# EAGLE design PixelWing_rev0.1 (EAGLE 9.5.2)
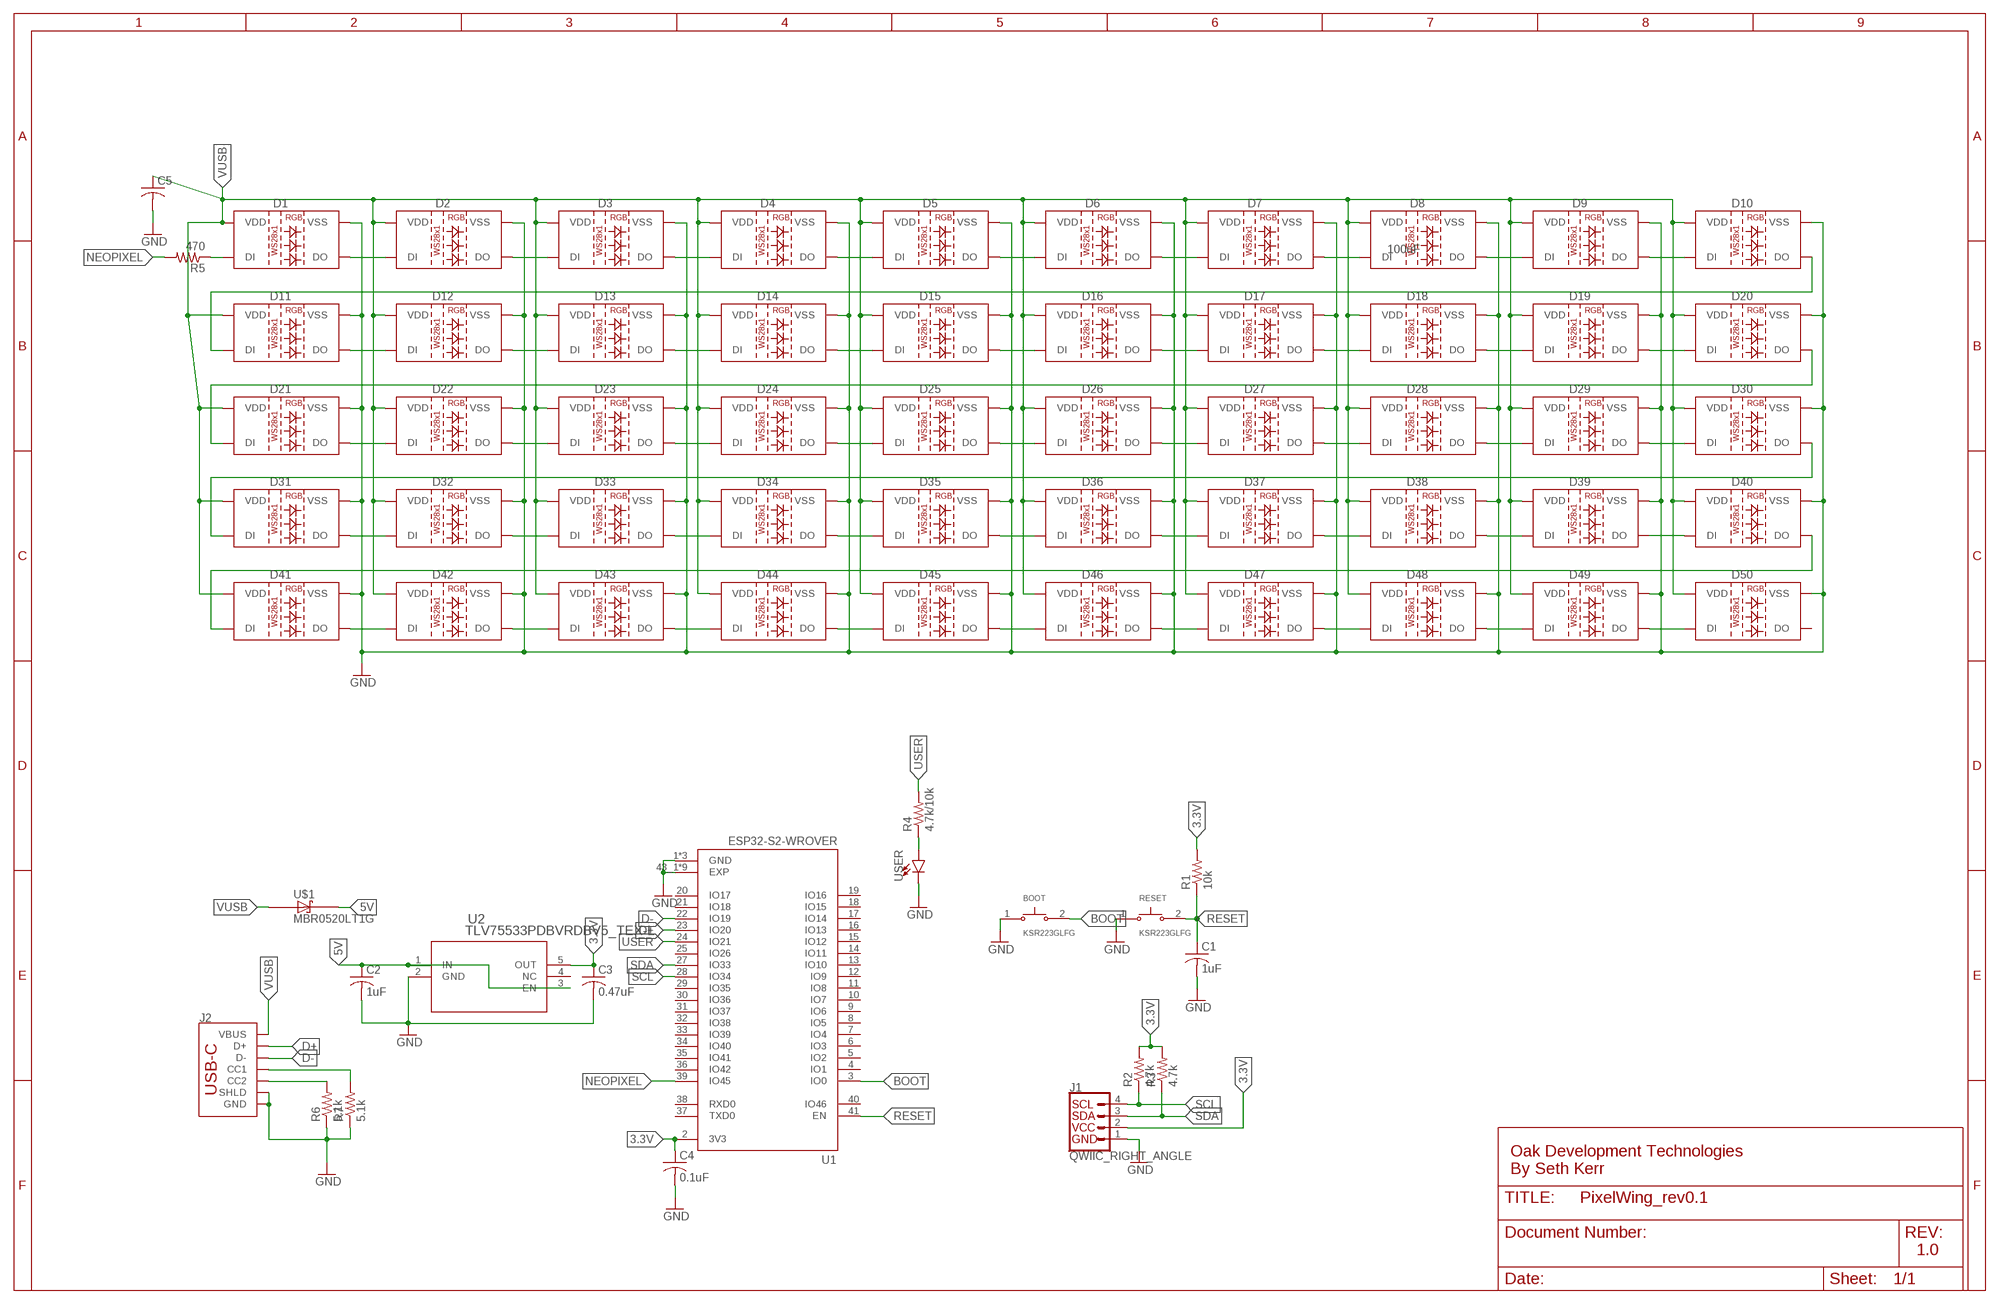
[diagram p0: schematic, sheet 1]

## Parts
BOOT  KSR223GLFG  [SW_KSR223GLFG]
C1  1uF  C-USC0603  [C0603]
C2  1uF  C-USC0603  [C0603]
C3  0.47uF  C-USC0603  [C0603]
C4  0.1uF  C-USC0603  [C0603]
C5  100uF  C-USC1206  [C1206]
D1  WS2812BWS2812B-3535  [WS2812-3535]
D2  WS2812BWS2812B-3535  [WS2812-3535]
D3  WS2812BWS2812B-3535  [WS2812-3535]
D4  WS2812BWS2812B-3535  [WS2812-3535]
D5  WS2812BWS2812B-3535  [WS2812-3535]
D6  WS2812BWS2812B-3535  [WS2812-3535]
D7  WS2812BWS2812B-3535  [WS2812-3535]
D8  WS2812BWS2812B-3535  [WS2812-3535]
D9  WS2812BWS2812B-3535  [WS2812-3535]
D10  WS2812BWS2812B-3535  [WS2812-3535]
D11  WS2812BWS2812B-3535  [WS2812-3535]
D12  WS2812BWS2812B-3535  [WS2812-3535]
D13  WS2812BWS2812B-3535  [WS2812-3535]
D14  WS2812BWS2812B-3535  [WS2812-3535]
D15  WS2812BWS2812B-3535  [WS2812-3535]
D16  WS2812BWS2812B-3535  [WS2812-3535]
D17  WS2812BWS2812B-3535  [WS2812-3535]
D18  WS2812BWS2812B-3535  [WS2812-3535]
D19  WS2812BWS2812B-3535  [WS2812-3535]
D20  WS2812BWS2812B-3535  [WS2812-3535]
D21  WS2812BWS2812B-3535  [WS2812-3535]
D22  WS2812BWS2812B-3535  [WS2812-3535]
D23  WS2812BWS2812B-3535  [WS2812-3535]
D24  WS2812BWS2812B-3535  [WS2812-3535]
D25  WS2812BWS2812B-3535  [WS2812-3535]
D26  WS2812BWS2812B-3535  [WS2812-3535]
D27  WS2812BWS2812B-3535  [WS2812-3535]
D28  WS2812BWS2812B-3535  [WS2812-3535]
D29  WS2812BWS2812B-3535  [WS2812-3535]
D30  WS2812BWS2812B-3535  [WS2812-3535]
D31  WS2812BWS2812B-3535  [WS2812-3535]
D32  WS2812BWS2812B-3535  [WS2812-3535]
D33  WS2812BWS2812B-3535  [WS2812-3535]
D34  WS2812BWS2812B-3535  [WS2812-3535]
D35  WS2812BWS2812B-3535  [WS2812-3535]
D36  WS2812BWS2812B-3535  [WS2812-3535]
D37  WS2812BWS2812B-3535  [WS2812-3535]
D38  WS2812BWS2812B-3535  [WS2812-3535]
D39  WS2812BWS2812B-3535  [WS2812-3535]
D40  WS2812BWS2812B-3535  [WS2812-3535]
D41  WS2812BWS2812B-3535  [WS2812-3535]
D42  WS2812BWS2812B-3535  [WS2812-3535]
D43  WS2812BWS2812B-3535  [WS2812-3535]
D44  WS2812BWS2812B-3535  [WS2812-3535]
D45  WS2812BWS2812B-3535  [WS2812-3535]
D46  WS2812BWS2812B-3535  [WS2812-3535]
D47  WS2812BWS2812B-3535  [WS2812-3535]
D48  WS2812BWS2812B-3535  [WS2812-3535]
D49  WS2812BWS2812B-3535  [WS2812-3535]
D50  WS2812BWS2812B-3535  [WS2812-3535]
J1  QWIIC_RIGHT_ANGLE  QWIIC_CONNECTORJS-1MM  [JST04_1MM_RA]
J2  USB_C_2-LAYER_PADS  [USB-C-16P-2LAYER-PADS]
R1  10k  R-US_R0603  [R0603]
R2  4.7k  R-US_R0603  [R0603]
R3  4.7k  R-US_R0603  [R0603]
R4  4.7k/10k  R-US_R0603  [R0603]
R5  470  R-US_R0603  [R0603]
R6  5.1k  R-US_R0603  [R0603]
R7  5.1k  R-US_R0603  [R0603]
RESET  KSR223GLFG  [SW_KSR223GLFG]
U1  ESP32-S2-WROVER  [MODULE_ESP32-S2-WROVER]
U2  TLV75533PDBVRDBV5_TEX-L  [DBV5_TEX-L]
U$1  MBR0520LT1G  [SOD3716X117(SOD-123)]
USER  LED0603  [LED-0603]

## Nets
3.3V: C3.1 C4.1 J1.2 R1.2 R2.2 R3.2 U1.2(3V3) U2.5(OUT)
5V: C2.1 U2.1(IN) U2.3(EN) U$1.1(C)
BOOT: BOOT.2 U1.3(IO0)
D+: J2.A6(D+) J2.B6(D+) U1.23(IO20)
D-: J2.A7(D-) J2.B7(D-) U1.22(IO19)
GND: BOOT.1 C1.2 C2.2 C3.2 C4.2 C5.2 D1.VSS D2.VSS D3.VSS D4.VSS D5.VSS D6.VSS D7.VSS D8.VSS D9.VSS D10.VSS D11.VSS D12.VSS D13.VSS D14.VSS D15.VSS D16.VSS D17.VSS D18.VSS D19.VSS D20.VSS D21.VSS D22.VSS D23.VSS D24.VSS D25.VSS D26.VSS D27.VSS D28.VSS D29.VSS D30.VSS D31.VSS D32.VSS D33.VSS D34.VSS D35.VSS D36.VSS D37.VSS D38.VSS D39.VSS D40.VSS D41.VSS D42.VSS D43.VSS D44.VSS D45.VSS D46.VSS D47.VSS D48.VSS D49.VSS D50.VSS J1.1 J2.GND J2.GND2(GND) J2.P$1(SHLD) J2.P$2(SHLD) J2.P$3(SHLD) J2.P$4(SHLD) J2.SHLD1(SHLD) J2.SHLD2(SHLD) J2.SHLD3(SHLD) J2.SHLD4(SHLD) R6.1 R7.1 RESET.1 U1.1(GND) U1.26(GND) U1.42(GND) U1.43_1(EXP) U1.43_2(EXP) U1.43_3(EXP) U1.43_4(EXP) U1.43_5(EXP) U1.43_6(EXP) U1.43_7(EXP) U1.43_8(EXP) U1.43_9(EXP) U2.2(GND) USER.C
N$1: R4.1 USER.A
N$2: D1.DIN(DI) R5.1
N$6: J2.A5(CC1) R7.2
N$7: J2.B5(CC2) R6.2
N$10: D41.DOUT(DO) D42.DIN(DI)
N$11: D42.DOUT(DO) D43.DIN(DI)
N$12: D43.DOUT(DO) D44.DIN(DI)
N$13: D44.DOUT(DO) D45.DIN(DI)
N$14: D45.DOUT(DO) D46.DIN(DI)
N$15: D46.DOUT(DO) D47.DIN(DI)
N$16: D47.DOUT(DO) D48.DIN(DI)
N$17: D48.DOUT(DO) D49.DIN(DI)
N$18: D49.DOUT(DO) D50.DIN(DI)
N$19: D40.DOUT(DO) D41.DIN(DI)
N$20: D31.DOUT(DO) D32.DIN(DI)
N$21: D32.DOUT(DO) D33.DIN(DI)
N$22: D33.DOUT(DO) D34.DIN(DI)
N$23: D34.DOUT(DO) D35.DIN(DI)
N$24: D35.DOUT(DO) D36.DIN(DI)
N$25: D36.DOUT(DO) D37.DIN(DI)
N$26: D37.DOUT(DO) D38.DIN(DI)
N$27: D38.DOUT(DO) D39.DIN(DI)
N$28: D39.DOUT(DO) D40.DIN(DI)
N$29: D30.DOUT(DO) D31.DIN(DI)
N$30: D21.DOUT(DO) D22.DIN(DI)
N$31: D22.DOUT(DO) D23.DIN(DI)
N$32: D23.DOUT(DO) D24.DIN(DI)
N$33: D24.DOUT(DO) D25.DIN(DI)
N$34: D25.DOUT(DO) D26.DIN(DI)
N$35: D26.DOUT(DO) D27.DIN(DI)
N$36: D27.DOUT(DO) D28.DIN(DI)
N$37: D28.DOUT(DO) D29.DIN(DI)
N$38: D29.DOUT(DO) D30.DIN(DI)
N$39: D20.DOUT(DO) D21.DIN(DI)
N$40: D11.DOUT(DO) D12.DIN(DI)
N$41: D12.DOUT(DO) D13.DIN(DI)
N$42: D13.DOUT(DO) D14.DIN(DI)
N$43: D14.DOUT(DO) D15.DIN(DI)
N$44: D15.DOUT(DO) D16.DIN(DI)
N$45: D16.DOUT(DO) D17.DIN(DI)
N$46: D17.DOUT(DO) D18.DIN(DI)
N$47: D18.DOUT(DO) D19.DIN(DI)
N$48: D19.DOUT(DO) D20.DIN(DI)
N$49: D10.DOUT(DO) D11.DIN(DI)
N$50: D1.DOUT(DO) D2.DIN(DI)
N$51: D2.DOUT(DO) D3.DIN(DI)
N$52: D3.DOUT(DO) D4.DIN(DI)
N$53: D4.DOUT(DO) D5.DIN(DI)
N$54: D5.DOUT(DO) D6.DIN(DI)
N$55: D6.DOUT(DO) D7.DIN(DI)
N$56: D7.DOUT(DO) D8.DIN(DI)
N$57: D8.DOUT(DO) D9.DIN(DI)
N$58: D9.DOUT(DO) D10.DIN(DI)
NEOPIXEL: R5.2 U1.39(IO45)
RESET: C1.1 R1.1 RESET.2 U1.41(EN)
SCL: J1.4 R2.1 U1.28(IO34)
SDA: J1.3 R3.1 U1.27(IO33)
USER: R4.2 U1.24(IO21)
VUSB: C5.1 D1.VDD D2.VDD D3.VDD D4.VDD D5.VDD D6.VDD D7.VDD D8.VDD D9.VDD D10.VDD D11.VDD D12.VDD D13.VDD D14.VDD D15.VDD D16.VDD D17.VDD D18.VDD D19.VDD D20.VDD D21.VDD D22.VDD D23.VDD D24.VDD D25.VDD D26.VDD D27.VDD D28.VDD D29.VDD D30.VDD D31.VDD D32.VDD D33.VDD D34.VDD D35.VDD D36.VDD D37.VDD D38.VDD D39.VDD D40.VDD D41.VDD D42.VDD D43.VDD D44.VDD D45.VDD D46.VDD D47.VDD D48.VDD D49.VDD D50.VDD J2.VBUS1(VBUS) J2.VBUS2(VBUS) U$1.2(A)
Unconnected: D50.DOUT(DO) U1.4(IO1) U1.5(IO2) U1.6(IO3) U1.7(IO4) U1.8(IO5) U1.9(IO6) U1.10(IO7) U1.11(IO8) U1.12(IO9) U1.13(IO10) U1.14(IO11) U1.15(IO12) U1.16(IO13) U1.17(IO14) U1.18(IO15) U1.19(IO16) U1.20(IO17) U1.21(IO18) U1.25(IO26) U1.29(IO35) U1.30(IO36) U1.31(IO37) U1.32(IO38) U1.33(IO39) U1.34(IO40) U1.35(IO41) U1.36(IO42) U1.37(TXD0) U1.38(RXD0) U1.40(IO46) U2.4(NC)

## Notes on the sheet
- Oak Development Technologies
  By Seth Kerr
- 1.0

## Library data of the parts
BOOT RESET = KSR223GLFG:KSR223GLFG: Switch Tactile N.O. SPST Round Button Gull Wing 0.01A 32VDC 0.2VA 200000Cycles 2N SMD Automotive T/R; AVAILABILITY: Unavailable; DESCRIPTION: Tactile Switch SPST-NO Top Actuated Surface Mount; MF: C&K; MP: KSR223GLFG; PACKAGE: None; PRICE: None
C1-C5 = rcl:C-US: CAPACITOR, American symbol; SPICEPREFIX: C
D1-D50 = SparkFun-LED:WS2812B: WS2812B SMD addressable RGB LED 5x5mm SMD LED with built-in controller IC. Color: Red/Green/Blue mC Rating: RGB: 390, 660, 180 mcd Forward Voltage: RGB: 2.0, 3.0, 3.0 V Packages:WS2812B SparkFun Products: Blynk Board - ESP8266 <https://www.sparkfun.com/products/13794>
J1 = SparkFun-Connectors:QWIIC_CONNECTOR: SparkFun I2C Standard Qwiic Connector An SMD 1mm pitch JST connector makes it easy and quick (get it? Qwiic?) to connect I2C devices to each other. The Qwiic system <http://www.sparkfun.com/qwiic> enables fast and solderless connection between popular platforms and various sensors and actuators. We carry 200mm <https://www.sparkfun.com/products/14204>, 100mm <https://www.sparkfun.com/products/14205>, 50mm <https://www.sparkfun.com/products/14206>, and breadboard friendly <https://www.sparkfun.com/products/14207> Qwiic cables. We also offer 10 pcs strips <https://www.sparkfun.com/products/14323> the SMD connectors.; PROD_ID: CONN-13694
J2 = SparkFun-Connectors:USB_C: USB Type C 16Pin Connector Super Speed pins not available on the 16-pin purely SMD connector so this part is best for USB 2.0 implementations. D1 and D2 are tied together enabling D+/- no matter which way the cable is plugged into the connector. The two channel configuration pins (CC1/2) are exposed. These are normally connected to ground via 5.1k resistors but can be reconfigured for high current/high power applications.; PROD_ID: CONN-14122
R1-R7 = rcl:R-US_: RESISTOR, American symbol; SPICEPREFIX: R
U1 = ESP32-S2-WROVER:ESP32-S2-WROVER: WiFi 802.11b/g/n Transceiver Module 2.4GHz PCB Trace Surface Mount Check prices <https://pricing.snapeda.com/parts/ESP32-S2-WROVER/Espressif%20Systems/view-part?ref=eda>; AVAILABILITY: In Stock; DESCRIPTION: WiFi 802.11b/g/n Transceiver Module 2.4GHz PCB Trace Surface Mount; MF: Espressif Systems; MP: ESP32-S2-WROVER; PACKAGE: None; PRICE: None
U2 = TLV75533pdbvr:TLV75533PDBVR; COPYRIGHT: Copyright (C) 2018 Accelerated Designs. All rights reserved; MANUFACTURER_PART_NUMBER: TLV75533PDBVR; SOURCELIBRARY: TI_2019-06-18; VENDOR: Texas Instruments
U$1 = MBR0520LT1G:MBR0520LT1G: Surface Mount Schottky Power Rectifier Plastic SOD−123 Package; AVAILABILITY: Unavailable; DESCRIPTION: Diode Schottky 20V 500mA Surface Mount SOD-123; MF: ON Semiconductor; MP: MBR0520LT1G; PACKAGE: SOD-123 ON Semiconductor; PRICE: None
USER = SparkFun-LED:LED: LED (Generic) Standard schematic elements and footprints for 5mm, 3mm, 1206, and 0603 sized LEDs. Generic LEDs with no color specified.

## Board
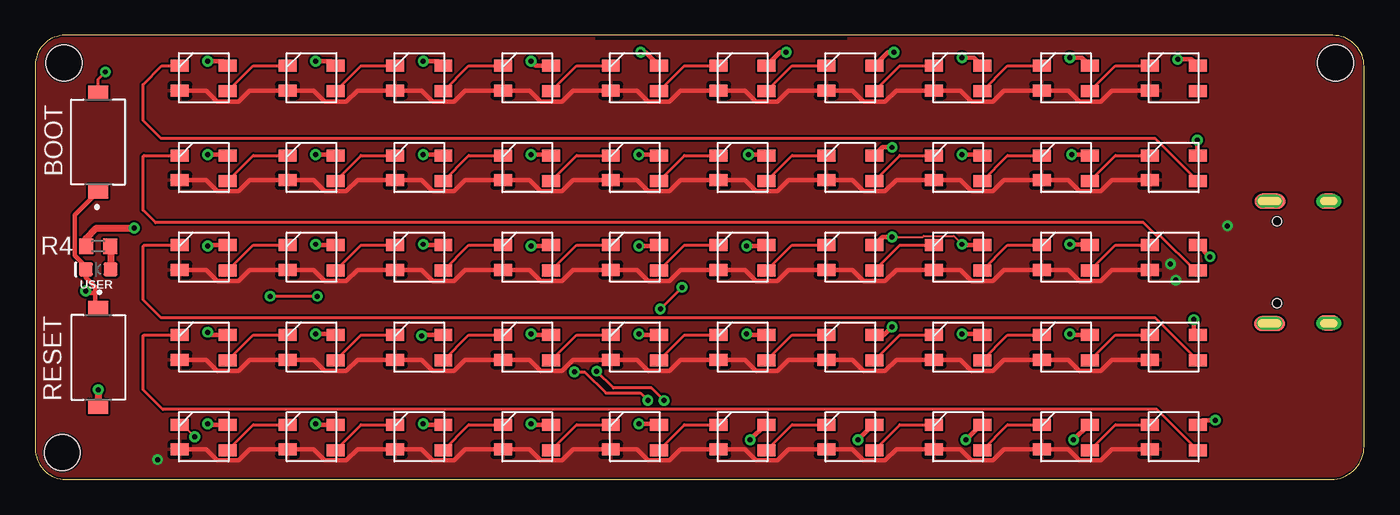
[diagram p1: board, top side]
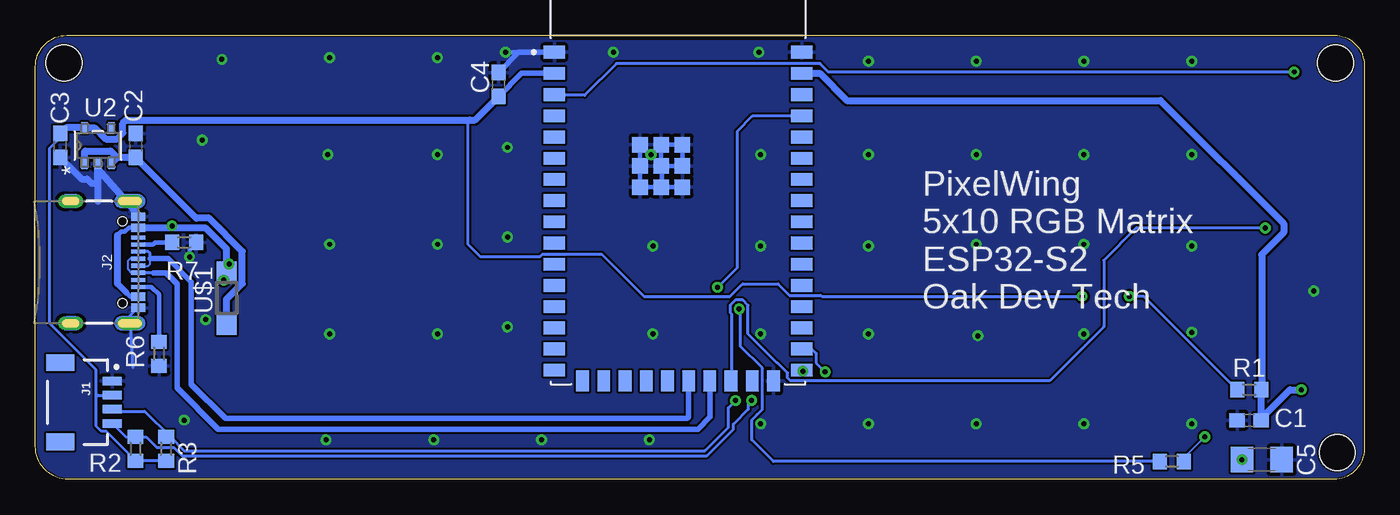
[diagram p2: board, bottom side, seen from below]

Size 93.96 x 31.42 mm. Coordinates in mm from the lower left corner, seen from the top.
Outline: 91.74,31.42 2.11,31.42 arc90 0,29.31 0,2.15 arc90 2.15,0 91.61,0 arc90 93.96,2.35 93.96,29.2 arc90 91.74,31.42
Copper layers (1*16): Top 0.035mm / dielectric 1.5mm / Bottom 0.035mm
Design rules "default *": minimum track width 6mil, minimum drill 0.35mm, track to track 6mil, track to pad 6mil, pad to pad 6mil, via to via 6mil, smd to smd 6mil, copper to edge 5mil, drill to drill 5mil, minimum pad ring 10mil, minimum via ring 8mil, stop-mask expansion 1mil, vias tented up to drill 15mil, thermal gap 10mil
Holes 2.54 mm at 91.95,29.46 2.03,29.46 1.91,1.91

### Footprints (pad centres in the part's own frame; a part is rotated, then mirrored left to right if it is on the bottom)
SW_KSR223GLFG = smd 1 x 1.4: 1 -3.5,0; 2 3.5,0
C0603 = smd 1.1 x 1: 1 -0.85,0; 2 0.85,0
C1206 = smd 1.6 x 1.8: 1 -1.4,0; 2 1.4,0
WS2812-3535 = smd 1.27 x 0.85: DIN 0.05,2.6; DOUT 3.45,0.8; VDD 0.05,0.85; VSS 3.45,2.6
JST04_1MM_RA = smd 0.6 x 1.35: 1 -1.5,0; 2 -0.5,0; 3 0.5,0; 4 1.5,0 | smd 1.2 x 2: NC1 2.8,-3.675; NC2 -2.8,-3.675
USB-C-16P-2LAYER-PADS = smd 0.3 x 1: A5 -1.25,-0.34; A6 -0.25,-0.34; A7 0.25,-0.34; A8 1.25,-0.34; B5 1.75,-0.34; B6 0.75,-0.34; B7 -0.75,-0.34; B8 -1.75,-0.34 | smd 0.6 x 1: GND -3.225,-0.34; GND2 3.225,-0.34; VBUS1 -2.45,-0.34; VBUS2 2.45,-0.34 | smd 1.067 x 2.184 bottom: P$1 -4.318,-0.94; P$2 4.343,-0.914 | smd 1.067 x 1.676 bottom: P$3 -4.318,-5.08; P$4 4.293,-5.08 | drill 0.4 pad 0.6 long: SHLD1 -4.318,-0.915; SHLD2 4.318,-0.915; SHLD3 -4.318,-5.095; SHLD4 4.318,-5.095 | hole 0.65: -2.89,-1.445; 2.89,-1.445
R0603 = smd 1 x 1.1: 1 -0.85,0; 2 0.85,0
MODULE_ESP32-S2-WROVER = smd 1.5 x 0.9: 1 -8.75,8; 2 -8.75,6.5; 3 -8.75,5; 4 -8.75,3.5; 5 -8.75,2; 6 -8.75,0.5; 7 -8.75,-1; 8 -8.75,-2.5; 9 -8.75,-4; 10 -8.75,-5.5; 11 -8.75,-7; 12 -8.75,-8.5; 13 -8.75,-10; 14 -8.75,-11.5; 15 -8.75,-13; 16 -8.75,-14.5; 27 8.75,-14.5; 28 8.75,-13; 29 8.75,-11.5; 30 8.75,-10; 31 8.75,-8.5; 32 8.75,-7; 33 8.75,-5.5; 34 8.75,-4; 35 8.75,-2.5; 36 8.75,-1; 37 8.75,0.5; 38 8.75,2; 39 8.75,3.5; 40 8.75,5; 41 8.75,6.5; 42 8.75,8 | smd 0.9 x 1.5: 17 -6.75,-15.25; 18 -5.25,-15.25; 19 -3.75,-15.25; 20 -2.25,-15.25; 21 -0.75,-15.25; 22 0.75,-15.25; 23 2.25,-15.25; 24 3.75,-15.25; 25 5.25,-15.25; 26 6.75,-15.25 | smd 1.1 x 1.1: 43_1 -2.69,1.45; 43_2 -1.19,1.45; 43_3 0.31,1.45; 43_4 -2.69,-0.05; 43_5 -1.19,-0.05; 43_6 0.31,-0.05; 43_7 -2.69,-1.55; 43_8 -1.19,-1.55; 43_9 0.31,-1.55
DBV5_TEX-L = smd 0.775 x 0.457: 1 -1.264,0.95; 2 -1.264,0; 3 -1.264,-0.95; 4 1.264,-0.95; 5 1.264,0.95
SOD3716X117(SOD-123) = smd 1.4 x 1.4: 1 -1.9,0.051; 2 1.9,0.051
LED-0603 = smd 1 x 1: A -0.877,0; C 0.877,0

### Placement (x,y rotation side)
BOOT  4.45,23.88 90 top
C1  8.13,4.19 180 bottom
C2  86.87,23.62 90 bottom
C3  92.2,23.62 270 bottom
C4  61.21,27.94 90 bottom
C5  7.24,1.4 0 bottom
D1  10.16,1.27 0 top
D2  17.78,1.27 0 top
D3  25.4,1.27 0 top
D4  33.02,1.27 0 top
D5  40.64,1.27 0 top
D6  48.26,1.27 0 top
D7  55.88,1.27 0 top
D8  63.5,1.27 0 top
D9  71.12,1.27 0 top
D10  78.74,1.27 0 top
D11  10.16,7.62 0 top
D12  17.78,7.62 0 top
D13  25.4,7.62 0 top
D14  33.02,7.62 0 top
D15  40.64,7.62 0 top
D16  48.26,7.62 0 top
D17  55.88,7.62 0 top
D18  63.5,7.62 0 top
D19  71.12,7.62 0 top
D20  78.74,7.62 0 top
D21  10.16,13.97 0 top
D22  17.78,13.97 0 top
D23  25.4,13.97 0 top
D24  33.02,13.97 0 top
D25  40.64,13.97 0 top
D26  48.26,13.97 0 top
D27  55.88,13.97 0 top
D28  63.5,13.97 0 top
D29  71.12,13.97 0 top
D30  78.74,13.97 0 top
D31  10.16,20.32 0 top
D32  17.78,20.32 0 top
D33  25.4,20.32 0 top
D34  33.02,20.32 0 top
D35  40.64,20.32 0 top
D36  48.26,20.32 0 top
D37  55.88,20.32 0 top
D38  63.5,20.32 0 top
D39  71.12,20.32 0 top
D40  78.74,20.32 0 top
D41  10.16,26.67 0 top
D42  17.78,26.67 0 top
D43  25.4,26.67 0 top
D44  33.02,26.67 0 top
D45  40.64,26.67 0 top
D46  48.26,26.67 0 top
D47  55.88,26.67 0 top
D48  63.5,26.67 0 top
D49  71.12,26.67 0 top
D50  78.74,26.67 0 top
J1  88.52,5.46 270 bottom
J2  86.36,15.37 270 bottom
R1  8.13,6.35 180 bottom
R2  86.87,2.16 270 bottom
R3  84.71,2.16 270 bottom
R4  4.45,16.51 180 top
R5  13.59,1.27 180 bottom
R6  85.22,8.89 90 bottom
R7  83.44,16.76 180 bottom
RESET  4.45,8.64 270 top
U1  48.51,22.23 0 bottom
U2  89.53,23.62 90 bottom
U$1  80.39,12.83 90 bottom
USER  4.45,14.86 180 top

### Tracks (layer width: path | path; a pad name or v marks a point on that pad's centre or on a via)
3.3V  (via drill 0.35)
  Top 0.203: v19.94,12.95 v16.6,12.95
  Bottom 0.203: R1.2 15.58,12.95 v16.6,12.95 | 63.25,25.43 63.37,25.3 63.37,16.64 62.48,15.75 58.3,15.75 58.12,15.93 53.9,15.93 50.93,12.95 44.83,12.95 43.94,13.84 41.44,13.84 40.62,13.02 38.42,13.02 38.35,12.95 v19.94,12.95 | R3.2 R2.2 88.97,3.41 89.3,3.41 89.66,3.77 89.66,5.84 | 89.66,5.84 89.54,5.96 J1.2 | 89.66,5.84 89.66,7.75 92.96,11.04 92.96,23.43 92.2,24.18 C3.1
  Bottom 0.406: U1.2 59.58,28.73 C4.1
  Bottom 0.508: C3.1 91.79,24.89 U2.5 89.78,24.89 88.98,24.09 88.19,24.09 87.77,24.51 87.77,25.19 87.54,25.43 63.25,25.43 62.88,25.43 C4.1
5V
  Bottom 0.508: U$1.1 80.44,12.75 79.33,13.86 79.33,16.13 81.68,18.48 82.57,18.48 C2.1 88.17,22.77 | 88.17,22.77 U2.3 | U2.1 90.48,23.18 90.42,23.24 88.65,23.24 88.17,22.77
BOOT  (via drill 0.35)
  Top 0.203: BOOT.2 4.45,28.32 v4.95,28.83
  Bottom 0.203: v4.95,28.83 37.88,28.83 38.48,29.43 52.87,29.43 55.12,27.18 57.22,27.18 U1.3
D+
  Bottom 0.152: J2.A6 87.25,15.62 87.43,15.44 87.43,14.87 87.17,14.62 86.74,14.62 J2.B6
  Bottom 0.203: 85.6,14.61 86.73,14.61 86.74,14.62
  Bottom 0.406: U1.23 46.26,4.41 47.12,3.56 81.03,3.56 83.95,6.48 83.95,13.84 84.71,14.61 85.6,14.61
D-
  Bottom 0.152: J2.A7 85.98,15.11 85.85,15.24 85.85,16
  Bottom 0.203: 85.84,15.62 85.85,15.63 85.85,16 85.97,16.12 J2.B7
  Bottom 0.406: U1.22 47.76,4.43 47.88,4.32 80.52,4.32 82.93,6.73 82.93,13.97 84.58,15.62 85.84,15.62
GND  (via drill 0.35)
  Top 0.152: v60.58,17.14 62.74,17.14 62.82,17.22 64.94,17.22 65.6,16.57
  Top 0.305: BOOT.1 2.79,18.72 2.79,15.83 3.57,15.06 USER.C 3.57,14.29 4.24,13.62 4.24,13.21 | RESET.1 4.24,12.34 4.24,13.21 | 4.24,13.21 3.68,13.21 v3.56,13.34 | D40.VSS 82.17,22.94 v82.17,24 | D50.VSS 81.74,29.72 v80.77,29.72 | D49.VSS 74,29.84 v73.15,29.84 | D48.VSS 66.38,29.84 v65.53,29.84 | D47.VSS 60.29,30.23 v60.71,30.23 | D46.VSS 52.67,30.23 v53.09,30.23 | v42.8,30.23 43.13,30.23 D45.VSS | D44.VSS 35.37,29.27 v35.05,29.59 | v27.43,29.59 28.53,29.59 D43.VSS | v19.81,29.59 20.91,29.59 D42.VSS | v12.19,29.59 13.29,29.59 D41.VSS | v12.19,22.99 13.54,22.99 D31.VSS | v19.81,22.99 21.16,22.99 D32.VSS | v27.43,22.99 28.78,22.99 D33.VSS | v35.05,22.99 36.4,22.99 D34.VSS | v42.67,22.99 44.02,22.99 D35.VSS | v50.42,22.99 51.64,22.99 D36.VSS | v60.58,23.5 59.91,23.5 D37.VSS | v65.53,22.99 66.88,22.99 D38.VSS | v73.28,22.99 74.5,22.99 D39.VSS | D30.VSS 82.24,16.57 v83.06,15.75 | v73.15,16.64 74.5,16.64 D29.VSS | D20.VSS 81.92,10.49 v81.92,11.3 | D19.VSS 73.22,10.22 v73.15,10.29 | v65.53,10.29 66.88,10.29 D18.VSS | v60.58,10.79 60,10.22 D17.VSS | D16.VSS 50.36,10.22 v50.29,10.29 | D15.VSS 42.74,10.22 v42.67,10.29 | D14.VSS 35.12,10.22 v35.05,10.29 | D13.VSS 27.36,10.22 v27.3,10.16 | D3.VSS 27.5,3.87 v27.43,3.94 | D4.VSS 35.12,3.87 v35.05,3.94 | D2.VSS 19.88,3.87 v19.81,3.94 | D1.VSS 12.26,3.87 v12.19,3.94 | D11.VSS 12.39,10.22 v12.19,10.41 | v19.81,10.29 21.16,10.29 D12.VSS | D28.VSS 65.6,16.57 v65.53,16.64 | D27.VSS 59.91,17.14 v60.58,17.14 | D26.VSS 51.65,16.51 v50.29,16.51 | D25.VSS 44.03,16.51 v42.67,16.51 | D24.VSS 36.41,16.51 v35.05,16.51 | D23.VSS 27.5,16.57 v27.43,16.64 | D22.VSS 19.88,16.57 v19.81,16.64 | D21.VSS 12.25,16.57 v12.19,16.51
  Top 0.305: v73.41,2.79 74.48,3.87 D9.VSS | v65.79,2.79 66.86,3.87 D8.VSS | D10.VSS 82.51,4.19 v83.44,4.19 | v58.17,2.79 59.24,3.87 D7.VSS | v50.55,2.79 51.62,3.87 D6.VSS | v42.67,3.94 44.02,3.94 D5.VSS
  Bottom 0.203: J2.GND2 87.28,11.57 87.07,7.92
  Bottom 0.305: 59.56,30.23 v60.7,30.23 v60.71,30.23 | U1.43_2 49.73,23.68 v50.42,22.99 | U1.43_2 U1.43_5 49.66,22.18 | 49.66,22.18 U1.43_6 U1.43_3 U1.43_2 | U1.43_1 U1.43_4 U1.43_7 U1.43_8 | U1.43_8 49.66,20.72 49.66,22.18 | U1.43_8 U1.43_9 | R7.1 83.06,16.3 v83.06,15.75
  Bottom 0.406: U1.1 59.56,30.23 59.78,30.23 C4.2
  Bottom 0.508: J2.GND 86.7,18.7 89.58,21.98 89.53,19.69 89.53,20.95 | U2.2 89.53,20.95 | C3.2 90.69,21.26 90.31,21.26 90,20.95 89.53,20.95
  pour Bottom: -2.54,36.83 96.52,36.83 96.52,-1.27 -2.54,-1.27
N$1
  Top 0.508: R4.1 5.32,16.48 USER.A
N$2  (via drill 0.35)
  Top 0.152: v11.27,3.02 10.32,3.97 D1.DIN
  Bottom 0.152: R5.1 12.76,1.29 12.76,1.52 v11.27,3.02
N$6
  Bottom 0.305: R7.2 85.47,16.76 85.62,16.62 J2.A5
N$7
  Bottom 0.305: R6.2 85.22,13.08 85.75,13.62 J2.B5
N$10
  Top 0.203: D41.DOUT 15.41,29.27 D42.DIN
N$11
  Top 0.203: D42.DOUT 23.03,29.27 D43.DIN
N$12
  Top 0.203: D43.DOUT 30.65,29.27 D44.DIN
N$13
  Top 0.203: D44.DOUT 38.27,29.27 D45.DIN
N$14
  Top 0.203: D45.DOUT 45.89,29.27 D46.DIN
N$15
  Top 0.203: D46.DOUT 53.51,29.27 D47.DIN
N$16
  Top 0.203: D47.DOUT 61.13,29.27 D48.DIN
N$17
  Top 0.203: D48.DOUT 68.75,29.27 D49.DIN
N$18
  Top 0.203: D49.DOUT 76.37,29.27 D50.DIN
N$19
  Top 0.203: D40.DOUT 79.18,24.13 8.89,24.13 7.62,25.4 7.62,27.94 8.95,29.27 D41.DIN
N$20
  Top 0.203: D31.DOUT 15.41,22.92 D32.DIN
N$21
  Top 0.203: D32.DOUT 23.03,22.92 D33.DIN
N$22
  Top 0.203: D33.DOUT 30.65,22.92 D34.DIN
N$23
  Top 0.203: D34.DOUT 38.27,22.92 D35.DIN
N$24
  Top 0.203: D35.DOUT 45.89,22.92 D36.DIN
N$25
  Top 0.203: D36.DOUT 53.51,22.92 D37.DIN
N$26
  Top 0.203: D37.DOUT 61.13,22.92 D38.DIN
N$27
  Top 0.203: D38.DOUT 68.75,22.92 D39.DIN
N$28
  Top 0.203: D39.DOUT 76.37,22.92 D40.DIN
N$29
  Top 0.203: D30.DOUT 82.01,14.77 79.53,17.25 79.27,17.25 78.36,18.16 8.51,18.16 7.62,19.05 7.62,22.86 7.68,22.92 D31.DIN
N$30
  Top 0.203: D21.DOUT 15.41,16.57 D22.DIN
N$31
  Top 0.203: D22.DOUT 23.03,16.57 D23.DIN
N$32
  Top 0.203: D23.DOUT 30.65,16.57 D24.DIN
N$33
  Top 0.203: D24.DOUT 38.27,16.57 D25.DIN
N$34
  Top 0.203: D25.DOUT 45.89,16.57 D26.DIN
N$35
  Top 0.203: D26.DOUT 53.51,16.57 D27.DIN
N$36
  Top 0.203: D27.DOUT 61.13,16.57 D28.DIN
N$37
  Top 0.203: D28.DOUT 68.75,16.57 D29.DIN
N$38
  Top 0.203: D29.DOUT 76.37,16.57 D30.DIN
N$39
  Top 0.203: D20.DOUT 79.18,11.43 8.89,11.43 7.62,12.7 7.62,16.51 7.68,16.57 D21.DIN
N$40
  Top 0.203: D11.DOUT 15.41,10.22 D12.DIN
N$41
  Top 0.203: D12.DOUT 23.03,10.22 D13.DIN
N$42
  Top 0.203: D13.DOUT 30.65,10.22 D14.DIN
N$43
  Top 0.203: D14.DOUT 38.27,10.22 D15.DIN
N$44
  Top 0.203: D15.DOUT 45.89,10.22 D16.DIN
N$45
  Top 0.203: D16.DOUT 53.51,10.22 D17.DIN
N$46
  Top 0.203: D17.DOUT 61.13,10.22 D18.DIN
N$47
  Top 0.203: D18.DOUT 68.75,10.22 D19.DIN
N$48
  Top 0.203: D19.DOUT 76.37,10.22 D20.DIN
N$49
  Top 0.203: D10.DOUT 79.31,4.95 9.02,4.95 7.62,6.35 7.62,10.16 7.68,10.22 D11.DIN
N$50
  Top 0.203: D1.DOUT 15.41,3.87 D2.DIN
N$51
  Top 0.203: D2.DOUT 23.03,3.87 D3.DIN
N$52
  Top 0.203: D3.DOUT 30.65,3.87 D4.DIN
N$53
  Top 0.203: D4.DOUT 38.27,3.87 D5.DIN
N$54
  Top 0.203: D5.DOUT 45.89,3.87 D6.DIN
N$55
  Top 0.203: D6.DOUT 53.51,3.87 D7.DIN
N$56
  Top 0.203: D7.DOUT 61.13,3.87 D8.DIN
N$57
  Top 0.203: D8.DOUT 68.75,3.87 D9.DIN
N$58
  Top 0.203: D9.DOUT 76.37,3.87 D10.DIN
NEOPIXEL  (via drill 0.35)
  Top 0.203: v44.2,12.06 v45.72,13.59
  Bottom 0.203: v45.72,13.59 44.32,14.99 44.32,24.64 43.24,25.73 U1.39 | v44.2,12.06 44.13,12 44.13,9.46 42.55,7.87 42.55,4.95 42.93,4.57 43.3,4.2 43.3,2.8 41.78,1.27 R5.2
RESET  (via drill 0.35)
  Top 0.508: v4.45,6.35 RESET.2
  Bottom 0.508: U1.41 38.49,28.73 36.58,26.81 14.4,26.81 5.69,18.11 5.69,17.45 7.24,15.91 7.24,6.39 R1.1 7.28,4.32 | C1.1 7.28,4.32 | 7.28,4.32 5.25,6.35 v4.45,6.35
SCL  (via drill 0.35)
  Top 0.203: v43.31,5.59 42.78,6.12 40.34,6.12 38.85,7.61 v38.11,7.61
  Bottom 0.203: J1.4 87.57,3.01 R2.1 86.12,3.01 85.36,2.25 84.17,2.25 83.59,1.68 46.46,1.68 44.6,3.54 44.6,3.91 43.56,4.95 43.56,5.33 v43.31,5.59 | U1.28 39.07,9.22 38.76,8.91 38.76,8.25 v38.11,7.61
SDA  (via drill 0.35)
  Top 0.203: v44.46,5.58 43.57,6.47 40.88,6.47 v39.69,7.66
  Bottom 0.152: R3.1 84.61,3.02 84.45,3.02 84.44,3.03
  Bottom 0.203: J1.3 88.38,4.83 86.23,4.83 84.44,3.03 83.44,2.03 46.61,2.03 44.96,3.68 44.96,5.08 v44.46,5.58 | v39.69,7.66 U1.27
USER  (via drill 0.35)
  Top 0.508: R4.2 3.6,17.06 4.32,17.78 v6.99,17.78
  Bottom 0.203: v6.99,17.78 16.13,17.78 18.41,15.49 18.41,10.79 22.23,6.97 40.57,6.97 40.77,7.17 40.77,7.54 41.48,8.26 41.53,8.26 43.56,10.29 43.56,12.32 43.93,12.69 44.46,12.69 44.83,12.32 44.83,11.8 44.7,11.68 44.7,7.04 U1.24
VUSB  (via drill 0.35)
  Top 0.305: D50.VDD 76.11,27.52 75.33,26.74 73.81,26.74 73.03,27.52 D49.VDD 68.49,27.52 67.71,26.74 66.19,26.74 65.41,27.52 D48.VDD 60.87,27.52 60.09,26.74 58.57,26.74 57.79,27.52 D47.VDD 53.25,27.52 52.47,26.74 50.95,26.74 50.17,27.52 D46.VDD 45.63,27.52 44.85,26.74 43.33,26.74 42.55,27.52 D45.VDD 38.01,27.52 37.23,26.74 35.71,26.74 34.93,27.52 D44.VDD 30.39,27.52 29.61,26.74 28.09,26.74 27.31,27.52 D43.VDD 22.77,27.52 21.99,26.74 20.47,26.74 19.69,27.52 D42.VDD 15.15,27.52 14.37,26.74 12.85,26.74 12.07,27.52 D41.VDD | D31.VDD 12.07,21.17 12.85,20.39 14.37,20.39 15.15,21.17 D32.VDD 19.69,21.17 20.47,20.39 21.99,20.39 22.77,21.17 D33.VDD 27.31,21.17 28.09,20.39 29.61,20.39 30.39,21.17 D34.VDD 34.93,21.17 35.71,20.39 37.23,20.39 38.01,21.17 D35.VDD 42.55,21.17 43.33,20.39 44.85,20.39 45.63,21.17 D36.VDD 50.17,21.17 50.95,20.39 52.47,20.39 53.25,21.17 D37.VDD 57.79,21.17 58.57,20.39 60.09,20.39 60.87,21.17 D38.VDD 65.41,21.17 66.19,20.39 67.71,20.39 68.49,21.17 D39.VDD 73.03,21.17 73.81,20.39 75.33,20.39 76.11,21.17 D40.VDD | D30.VDD 76.11,14.82 75.33,14.04 73.81,14.04 73.03,14.82 D29.VDD 68.49,14.82 67.71,14.04 66.19,14.04 65.41,14.82 D28.VDD 60.87,14.82 60.09,14.04 58.57,14.04 57.79,14.82 D27.VDD 53.25,14.82 52.47,14.04 50.95,14.04 50.17,14.82 D26.VDD 45.63,14.82 44.85,14.04 43.33,14.04 42.55,14.82 D25.VDD 38.01,14.82 37.23,14.04 35.71,14.04 34.93,14.82 D24.VDD 30.39,14.82 29.61,14.04 28.09,14.04 27.31,14.82 D23.VDD 22.77,14.82 21.99,14.04 20.47,14.04 19.69,14.82 D22.VDD 15.15,14.82 14.37,14.04 12.85,14.04 12.07,14.82 D21.VDD
  Top 0.305: D11.VDD 12.07,8.47 12.85,7.69 14.37,7.69 15.15,8.47 D12.VDD 19.69,8.47 20.47,7.69 21.99,7.69 22.77,8.47 D13.VDD 27.31,8.47 28.09,7.69 29.61,7.69 30.39,8.47 D14.VDD 34.93,8.47 35.71,7.69 37.23,7.69 38.01,8.47 D15.VDD 42.55,8.47 43.33,7.69 44.85,7.69 45.63,8.47 D16.VDD 50.17,8.47 50.95,7.69 52.47,7.69 53.25,8.47 D17.VDD 57.79,8.47 58.57,7.69 60.09,7.69 60.87,8.47 D18.VDD 65.41,8.47 66.19,7.69 67.71,7.69 68.49,8.47 D19.VDD 73.03,8.47 73.81,7.69 75.33,7.69 76.11,8.47 D20.VDD | D10.VDD 76.11,2.12 75.33,1.34 73.81,1.34 73.03,2.12 D9.VDD 68.49,2.12 67.71,1.34 66.19,1.34 65.41,2.12 D8.VDD 60.87,2.12 60.09,1.34 58.57,1.34 57.79,2.12 D7.VDD 53.25,2.12 52.47,1.34 50.95,1.34 50.17,2.12 D6.VDD 45.63,2.12 44.85,1.34 43.33,1.34 42.55,2.12 D5.VDD 38.01,2.12 37.23,1.34 35.71,1.34 34.93,2.12 D4.VDD 30.39,2.12 29.61,1.34 28.09,1.34 27.31,2.12 D3.VDD 22.77,2.12 21.99,1.34 20.47,1.34 19.69,2.12 D2.VDD 15.15,2.12 14.37,1.34 12.85,1.34 12.07,2.12 D1.VDD
  Bottom 0.152: v84.3,17.94 84.3,17.82 | C5.1 8.89,1.27 C5.1
  Bottom 0.305: J2.VBUS2 87.21,12.92 87.5,13.21 | 88.14,17.27 87.88,17.53 87.63,17.53 87.34,17.82 J2.VBUS1
  Bottom 0.406: 87.5,13.21 88.14,13.84
  Bottom 0.508: 88.14,13.84 88.14,17.27 | J2.VBUS1 84.3,17.82 81.95,17.82 80.44,16.31 U$1.2
  other vias: 80.64,14.1 80.26,15.24 8.64,1.4
  pour Top: -3.81,38.1 97.92,38.1 97.92,-2.54 -3.81,-2.54

### Text on the board
bNames: PixelWing / 5x10 RGB Matrix / ESP32-S2 / Oak Dev Tech